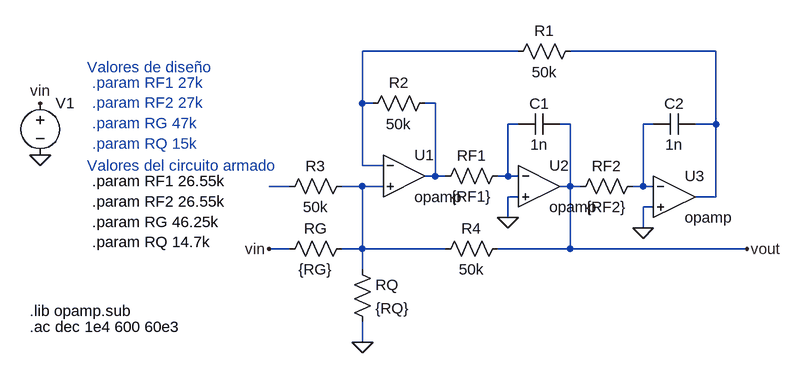
[diagram p0: schematic simulacion_circuital.asc]
simulacion_circuital.asc, the LTspice schematic file:
Version 4
SHEET 1 880 680
WIRE 416 144 176 144
WIRE 720 144 496 144
WIRE 176 224 176 144
WIRE 192 224 176 224
WIRE 288 224 272 224
WIRE 416 256 400 256
WIRE 496 256 480 256
WIRE 624 256 608 256
WIRE 720 256 720 144
WIRE 720 256 688 256
WIRE 176 320 176 224
WIRE 208 320 176 320
WIRE 288 336 288 224
WIRE 288 336 272 336
WIRE 304 336 288 336
WIRE 400 336 400 256
WIRE 400 336 384 336
WIRE 416 336 400 336
WIRE 64 352 32 352
WIRE 176 352 144 352
WIRE 208 352 176 352
WIRE 496 352 496 256
WIRE 496 352 480 352
WIRE 512 352 496 352
WIRE 608 352 608 256
WIRE 608 352 592 352
WIRE 624 352 608 352
WIRE 416 368 400 368
WIRE 720 368 720 256
WIRE 720 368 688 368
WIRE 624 384 608 384
WIRE 400 400 400 368
WIRE 608 416 608 384
WIRE 64 448 32 448
WIRE 176 448 176 352
WIRE 176 448 144 448
WIRE 304 448 176 448
WIRE 496 448 496 352
WIRE 496 448 384 448
WIRE 768 448 496 448
WIRE 176 480 176 448
WIRE 176 592 176 560
FLAG 400 400 0
FLAG 608 416 0
FLAG 32 448 vin
FLAG 768 448 vout
FLAG 176 592 0
FLAG -320 224 vin
FLAG -320 304 0
SYMBOL opamp 240 272 R0
SYMATTR InstName U1
SYMBOL opamp 448 288 R0
SYMATTR InstName U2
SYMBOL opamp 656 304 R0
SYMATTR InstName U3
SYMBOL res 288 208 R90
WINDOW 0 0 56 VBottom 2
WINDOW 3 32 56 VTop 2
SYMATTR InstName R2
SYMATTR Value 50k
SYMBOL res 400 320 R90
WINDOW 0 0 56 VBottom 2
WINDOW 3 32 56 VTop 2
SYMATTR InstName RF1
SYMATTR Value {RF1}
SYMBOL res 608 336 R90
WINDOW 0 0 56 VBottom 2
WINDOW 3 32 56 VTop 2
SYMATTR InstName RF2
SYMATTR Value {RF2}
SYMBOL res 512 128 R90
WINDOW 0 0 56 VBottom 2
WINDOW 3 32 56 VTop 2
SYMATTR InstName R1
SYMATTR Value 50k
SYMBOL res 160 336 R90
WINDOW 0 0 56 VBottom 2
WINDOW 3 32 56 VTop 2
SYMATTR InstName R3
SYMATTR Value 50k
SYMBOL res 160 432 R90
WINDOW 0 0 56 VBottom 2
WINDOW 3 32 56 VTop 2
SYMATTR InstName RG
SYMATTR Value {RG}
SYMBOL res 160 464 R0
SYMATTR InstName RQ
SYMATTR Value {RQ}
SYMBOL res 400 432 R90
WINDOW 0 0 56 VBottom 2
WINDOW 3 32 56 VTop 2
SYMATTR InstName R4
SYMATTR Value 50k
SYMBOL cap 480 240 R90
WINDOW 0 0 32 VBottom 2
WINDOW 3 32 32 VTop 2
SYMATTR InstName C1
SYMATTR Value 1n
SYMBOL cap 688 240 R90
WINDOW 0 0 32 VBottom 2
WINDOW 3 32 32 VTop 2
SYMATTR InstName C2
SYMATTR Value 1n
SYMBOL voltage -320 208 R0
SYMATTR InstName V1
SYMATTR Value ""
SYMATTR Value2 AC 10
TEXT -240 192 Left 2 ;.param RF1 27k\n.param RF2 27k\n.param RG 47k\n.param RQ 15k
TEXT -336 568 Left 2 !.ac dec 1e4 600 60e3
TEXT -336 544 Left 2 !.lib opamp.sub
TEXT -240 344 Left 2 !.param RF1 26.55k\n.param RF2 26.55k\n.param RG 46.25k\n.param RQ 14.7k
TEXT -248 168 Left 2 ;Valores de diseño
TEXT -248 320 Left 2 ;Valores del circuito armado

The netlist it stands for:
* simulacion_circuital.asc
XU1 N001 N007 N003 opamp Aol=100K GBW=10Meg  ; pins invin noninvin out
XU2 N004 0 vout opamp Aol=100K GBW=10Meg  ; pins invin noninvin out
XU3 N005 0 N002 opamp Aol=100K GBW=10Meg  ; pins invin noninvin out
R2 N003 N001 50k
RF1 N004 N003 {RF1}
RF2 N005 vout {RF2}
R1 N002 N001 50k
R3 N007 N006 50k
RG N007 vin {RG}
RQ N007 0 {RQ}
R4 vout N007 50k
C1 vout N004 1n
C2 N002 N005 1n
V1 vin 0 AC 10
* .param RF1 27k
* .param RF2 27k
* .param RG 47k
* .param RQ 15k
.ac dec 1e4 600 60e3
.lib opamp.sub
.param RF1 26.55k
.param RF2 26.55k
.param RG 46.25k
.param RQ 14.7k
* Valores de diseño
* Valores del circuito armado
.backanno
.end